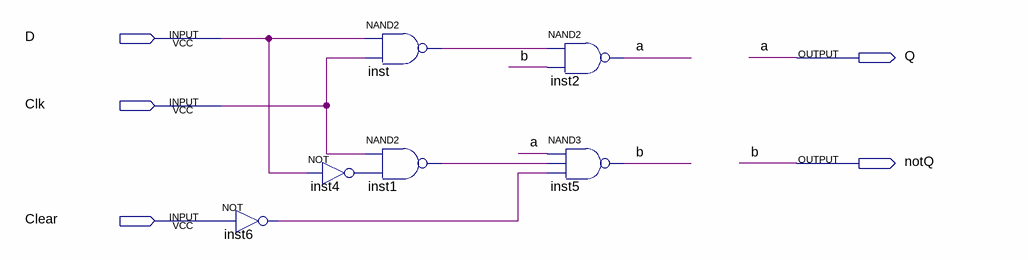
[diagram p0: schematic sheet]
// Quartus schematic D_Latch.bdf as structural Verilog: 6 symbols, 5 pins
module D_Latch (
  input  D,
  input  Clk,
  input  Clear,
  output Q,
  output notQ
);

  wire inst1_out, inst4_out, inst6_out, inst_out;

  not inst6 (inst6_out, Clear);
  not inst4 (inst4_out, D);
  nand inst (inst_out, D, Clk);
  nand inst1 (inst1_out, Clk, inst4_out);
  nand inst2 (Q, inst_out, notQ);
  nand inst5 (notQ, Q, inst1_out, inst6_out);

  // Other names for the same wires on the sheet: a = Q; b = notQ
endmodule
